# EAGLE design ch1 (EAGLE 9.2.2)
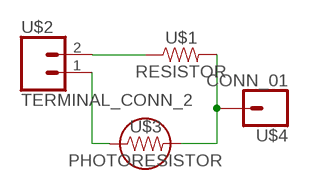
[diagram p0: schematic, sheet 1]

## Parts
U$1  RESISTOR  [RESISTOR]
U$2  TERMINAL_CONN_2  [TERMINAL_CONN_2]
U$3  PHOTORESISTOR  [PHOTORESISTOR]
U$4  CONN_01  [1X01]

## Nets
N$1: U$1.1 U$2.2
N$2: U$1.2 U$3.P$2 U$4.1
N$3: U$2.1 U$3.P$1

## Library data of the parts
U$1 = ECE5_WS(7):RESISTOR: This is a resistor
U$2 = ECE5_WS(7):TERMINAL_CONN_2: 2 pin terminal block
U$3 = ECE5_WS(7):PHOTORESISTOR: This is a photoresistor
U$4 = ECE5_WS(7):CONN_01: Header Pin - 1

## Board
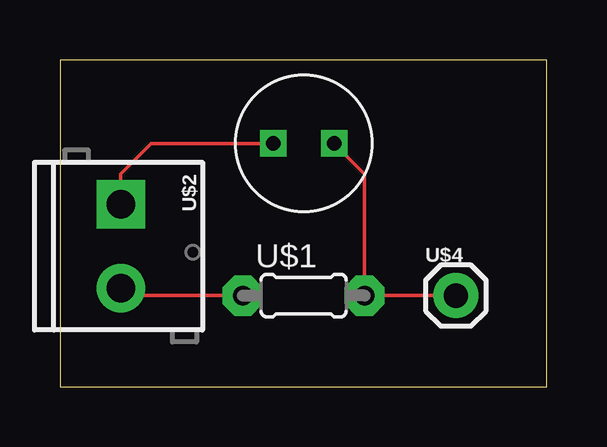
[diagram p1: board, top side]

Size 20.3 x 13.64 mm. Coordinates in mm from the lower left corner, seen from the top.
Outline: 0,0 20.3,0 20.3,13.64 0,13.64 0,0
Copper layers (1*16): Top 0.035mm / dielectric 1.5mm / Bottom 0.035mm
Design rules "default": minimum track width 6mil, minimum drill 0.35mm, track to track 6mil, track to pad 6mil, pad to pad 6mil, via to via 6mil, smd to smd 6mil, copper to edge 40mil, drill to drill 6mil, minimum pad ring 10mil, minimum via ring 8mil, stop-mask expansion 4mil, vias tented up to drill 0mil, thermal gap 10mil

### Footprints (pad centres in the part's own frame; a part is rotated, then mirrored left to right if it is on the bottom)
RESISTOR = drill 0.813 pad 1.676 octagon: 1 -2.54,0; 2 2.54,0
TERMINAL_CONN_2 = drill 1.2 pad 2.032 square: 1 0,0 | drill 1.2 pad 2.032: 2 3.5,0
PHOTORESISTOR = drill 0.6 square: P$1 -1.27,0; P$2 1.27,0
1X01 = drill 1.016 pad 1.88: 1 0,0

### Placement (x,y rotation side)
U$1  10.16,3.81 0 top
U$2  2.54,7.62 270 top
U$3  10.16,10.16 0 top
U$4  16.51,3.81 0 top

### Tracks (layer width: path | path; a pad name or v marks a point on that pad's centre or on a via)
N$1
  Top 0.152: U$1.1 2.85,3.81 U$2.2
N$2
  Top 0.152: U$3.P$2 12.7,8.89 U$1.2 U$4.1
N$3
  Top 0.152: U$3.P$1 3.81,10.16 2.54,8.89 U$2.1